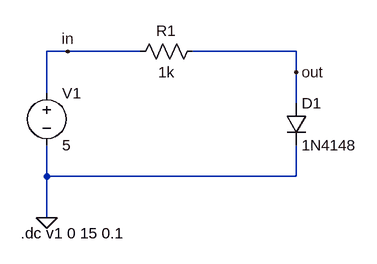
[diagram p0: schematic Diode_real_1N4148.asc]
Diode_real_1N4148.asc, the LTspice schematic file:
Version 4.1
SHEET 1 880 680
WIRE 96 64 64 64
WIRE 208 64 96 64
WIRE 448 64 288 64
WIRE 448 96 448 64
WIRE 64 128 64 64
WIRE 448 144 448 96
WIRE 64 256 64 208
WIRE 448 256 448 208
WIRE 448 256 64 256
WIRE 64 320 64 256
FLAG 64 320 0
FLAG 96 64 in
FLAG 448 96 out
SYMBOL voltage 64 112 R0
SYMATTR InstName V1
SYMATTR Value 5
SYMBOL diode 432 144 R0
SYMATTR InstName D1
SYMATTR Value 1N4148
SYMBOL res 304 48 R90
WINDOW 0 0 56 VBottom 2
WINDOW 3 32 56 VTop 2
SYMATTR InstName R1
SYMATTR Value 1k
TEXT 24 344 Left 2 !.dc v1 0 15 0.1

The netlist it stands for:
* Diode_real_1N4148.asc
V1 in 0 5
D1 out 0 1N4148
R1 out in 1k
.model D D
.lib standard.dio
.dc v1 0 15 0.1
.backanno
.end